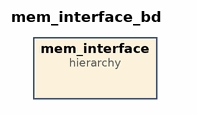
[diagram p0: block diagram of the top level]
# Vivado block design mem_interface_bd, xcku115-flva1517-2-e, Vivado 2018.1
create_bd_design mem_interface_bd

create_bd_cell -type hier mem_interface

# ---- hierarchy /mem_interface ----
current_bd_instance /mem_interface
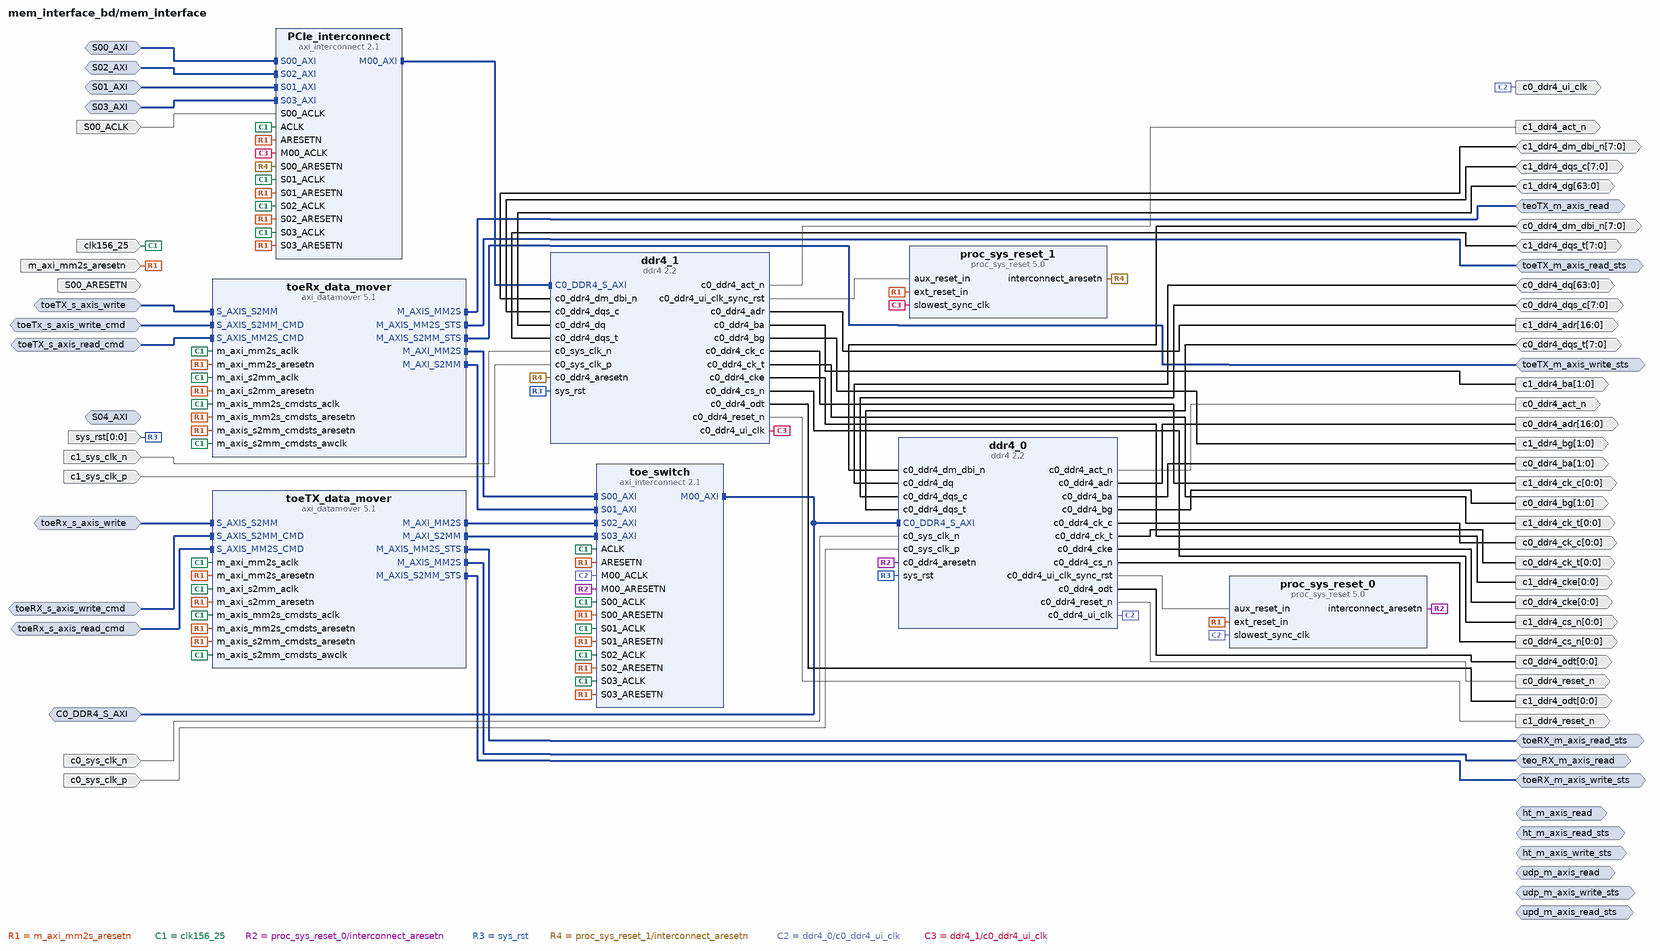
[diagram p1: block diagram inside /mem_interface]
create_bd_intf_pin -mode Master -vlnv xilinx.com:interface:axis_rtl:1.0 ht_m_axis_read
create_bd_intf_pin -mode Master -vlnv xilinx.com:interface:axis_rtl:1.0 udp_m_axis_write_sts
create_bd_intf_pin -mode Master -vlnv xilinx.com:interface:axis_rtl:1.0 ht_m_axis_write_sts
create_bd_intf_pin -mode Master -vlnv xilinx.com:interface:axis_rtl:1.0 toeRX_m_axis_read_sts
create_bd_intf_pin -mode Master -vlnv xilinx.com:interface:axis_rtl:1.0 teo_RX_m_axis_read
create_bd_intf_pin -mode Master -vlnv xilinx.com:interface:axis_rtl:1.0 ht_m_axis_read_sts
create_bd_intf_pin -mode Master -vlnv xilinx.com:interface:axis_rtl:1.0 toeRX_m_axis_write_sts
create_bd_intf_pin -mode Slave -vlnv xilinx.com:interface:axis_rtl:1.0 toeRx_s_axis_write
create_bd_intf_pin -mode Slave -vlnv xilinx.com:interface:axis_rtl:1.0 toeRX_s_axis_write_cmd
create_bd_intf_pin -mode Slave -vlnv xilinx.com:interface:aximm_rtl:1.0 S00_AXI
create_bd_intf_pin -mode Slave -vlnv xilinx.com:interface:aximm_rtl:1.0 S02_AXI
create_bd_intf_pin -mode Slave -vlnv xilinx.com:interface:aximm_rtl:1.0 S01_AXI
create_bd_intf_pin -mode Monitor -vlnv xilinx.com:interface:aximm_rtl:1.0 C0_DDR4_S_AXI
create_bd_intf_pin -mode Slave -vlnv xilinx.com:interface:axis_rtl:1.0 toeRx_s_axis_read_cmd
create_bd_intf_pin -mode Master -vlnv xilinx.com:interface:axis_rtl:1.0 udp_m_axis_read
create_bd_intf_pin -mode Slave -vlnv xilinx.com:interface:aximm_rtl:1.0 S04_AXI
create_bd_intf_pin -mode Slave -vlnv xilinx.com:interface:aximm_rtl:1.0 S03_AXI
create_bd_intf_pin -mode Master -vlnv xilinx.com:interface:axis_rtl:1.0 toeTX_m_axis_read_sts
create_bd_intf_pin -mode Master -vlnv xilinx.com:interface:axis_rtl:1.0 teoTX_m_axis_read
create_bd_intf_pin -mode Master -vlnv xilinx.com:interface:axis_rtl:1.0 toeTX_m_axis_write_sts
create_bd_intf_pin -mode Slave -vlnv xilinx.com:interface:axis_rtl:1.0 toeTX_s_axis_write
create_bd_intf_pin -mode Slave -vlnv xilinx.com:interface:axis_rtl:1.0 toeTx_s_axis_write_cmd
create_bd_intf_pin -mode Slave -vlnv xilinx.com:interface:axis_rtl:1.0 toeTX_s_axis_read_cmd
create_bd_intf_pin -mode Master -vlnv xilinx.com:interface:axis_rtl:1.0 upd_m_axis_read_sts
create_bd_pin -dir O c1_ddr4_reset_n
create_bd_pin -dir I -type clk clk156_25
create_bd_pin -dir O c0_ddr4_reset_n
create_bd_pin -dir O -from 1 -to 0 c0_ddr4_bg
create_bd_pin -dir O c0_ddr4_act_n
create_bd_pin -dir O -from 0 -to 0 c0_ddr4_odt
create_bd_pin -dir O -from 0 -to 0 c0_ddr4_cs_n
create_bd_pin -dir O -from 16 -to 0 c0_ddr4_adr
create_bd_pin -dir O -from 0 -to 0 -type clk c0_ddr4_ck_t
create_bd_pin -dir IO -from 7 -to 0 c0_ddr4_dqs_t
create_bd_pin -dir O -from 0 -to 0 -type clk c0_ddr4_ck_c
create_bd_pin -dir O -from 0 -to 0 c0_ddr4_cke
create_bd_pin -dir O -from 1 -to 0 c0_ddr4_ba
create_bd_pin -dir IO -from 63 -to 0 c0_ddr4_dq
create_bd_pin -dir O -from 1 -to 0 c1_ddr4_bg
create_bd_pin -dir IO -from 7 -to 0 c0_ddr4_dm_dbi_n
create_bd_pin -dir O -from 0 -to 0 c1_ddr4_odt
create_bd_pin -dir O c1_ddr4_act_n
create_bd_pin -dir O -from 16 -to 0 c1_ddr4_adr
create_bd_pin -dir O -from 1 -to 0 c1_ddr4_ba
create_bd_pin -dir O -from 0 -to 0 c1_ddr4_cke
create_bd_pin -dir O -from 0 -to 0 -type clk c1_ddr4_ck_c
create_bd_pin -dir O -from 0 -to 0 -type clk c1_ddr4_ck_t
create_bd_pin -dir IO -from 7 -to 0 c1_ddr4_dqs_c
create_bd_pin -dir IO -from 7 -to 0 c1_ddr4_dm_dbi_n
create_bd_pin -dir IO -from 63 -to 0 c1_ddr4_dg
create_bd_pin -dir IO -from 7 -to 0 c1_ddr4_dqs_t
create_bd_pin -dir O -from 0 -to 0 c1_ddr4_cs_n
create_bd_pin -dir IO -from 7 -to 0 c0_ddr4_dqs_c
create_bd_pin -dir I -from 0 -to 0 -type rst sys_rst
create_bd_pin -dir I -type clk c1_sys_clk_p
create_bd_pin -dir I -type clk c1_sys_clk_n
create_bd_pin -dir I -type clk c0_sys_clk_p
create_bd_pin -dir O -type clk c0_ddr4_ui_clk
create_bd_pin -dir I -type rst m_axi_mm2s_aresetn
create_bd_pin -dir I -type clk c0_sys_clk_n
create_bd_pin -dir I -type rst S00_ARESETN
create_bd_pin -dir I -type clk S00_ACLK

create_bd_cell -type ip -vlnv xilinx.com:ip:axi_datamover:5.1 toeRx_data_mover
set_property -dict [list \
  CONFIG.c_m_axi_mm2s_data_width 512 \
  CONFIG.c_m_axis_mm2s_tdata_width 64 \
  CONFIG.c_include_mm2s_dre true \
  CONFIG.c_mm2s_burst_size 16 \
  CONFIG.c_m_axi_s2mm_data_width 512 \
  CONFIG.c_include_s2mm_dre true \
  CONFIG.c_dummy 1 \
] [get_bd_cells toeRx_data_mover]
create_bd_cell -type ip -vlnv xilinx.com:ip:proc_sys_reset:5.0 proc_sys_reset_1
create_bd_cell -type ip -vlnv xilinx.com:ip:proc_sys_reset:5.0 proc_sys_reset_0
create_bd_cell -type ip -vlnv xilinx.com:ip:axi_datamover:5.1 toeTX_data_mover
set_property -dict [list \
  CONFIG.c_m_axi_mm2s_data_width 512 \
  CONFIG.c_m_axis_mm2s_tdata_width 64 \
  CONFIG.c_include_mm2s_dre true \
  CONFIG.c_mm2s_burst_size 16 \
  CONFIG.c_m_axi_s2mm_data_width 512 \
  CONFIG.c_include_s2mm_dre true \
  CONFIG.c_dummy 1 \
] [get_bd_cells toeTX_data_mover]
create_bd_cell -type ip -vlnv xilinx.com:ip:axi_interconnect:2.1 toe_switch
set_property -dict [list \
  CONFIG.NUM_SI 4 \
  CONFIG.NUM_MI 1 \
  CONFIG.ENABLE_ADVANCED_OPTIONS 1 \
  CONFIG.XBAR_DATA_WIDTH 512 \
  CONFIG.SYNCHRONIZATION_STAGES 3 \
  CONFIG.M00_HAS_REGSLICE 3 \
  CONFIG.S00_HAS_REGSLICE 3 \
  CONFIG.S01_HAS_REGSLICE 3 \
  CONFIG.S02_HAS_REGSLICE 3 \
  CONFIG.S03_HAS_REGSLICE 3 \
] [get_bd_cells toe_switch]
create_bd_cell -type ip -vlnv xilinx.com:ip:axi_interconnect:2.1 PCIe_interconnect
set_property -dict [list \
  CONFIG.NUM_SI 4 \
  CONFIG.NUM_MI 1 \
  CONFIG.ENABLE_ADVANCED_OPTIONS 1 \
  CONFIG.XBAR_DATA_WIDTH 512 \
  CONFIG.SYNCHRONIZATION_STAGES 3 \
  CONFIG.M00_HAS_REGSLICE 3 \
  CONFIG.S00_HAS_REGSLICE 3 \
  CONFIG.S01_HAS_REGSLICE 3 \
  CONFIG.S02_HAS_REGSLICE 3 \
  CONFIG.S03_HAS_REGSLICE 3 \
] [get_bd_cells PCIe_interconnect]
create_bd_cell -type ip -vlnv xilinx.com:ip:ddr4:2.2 ddr4_0
set_property -dict [list \
  CONFIG.C0.DDR4_DataWidth 64 \
  CONFIG.C0.DDR4_AxiDataWidth 512 \
  CONFIG.C0.DDR4_AxiAddressWidth 32 \
] [get_bd_cells ddr4_0]
create_bd_cell -type ip -vlnv xilinx.com:ip:ddr4:2.2 ddr4_1
set_property -dict [list \
  CONFIG.C0.DDR4_DataWidth 64 \
  CONFIG.C0.DDR4_AxiDataWidth 512 \
  CONFIG.C0.DDR4_AxiAddressWidth 32 \
] [get_bd_cells ddr4_1]

# ---- connections ----

current_bd_instance /mem_interface
connect_bd_intf_net [get_bd_intf_pins toeRx_data_mover/M_AXI_MM2S] [get_bd_intf_pins toe_switch/S00_AXI]
connect_bd_intf_net [get_bd_intf_pins toeRx_data_mover/M_AXI_S2MM] [get_bd_intf_pins toe_switch/S01_AXI]
connect_bd_intf_net [get_bd_intf_pins toeTX_data_mover/M_AXI_MM2S] [get_bd_intf_pins toe_switch/S02_AXI]
connect_bd_intf_net [get_bd_intf_pins toeTX_data_mover/M_AXI_S2MM] [get_bd_intf_pins toe_switch/S03_AXI]
connect_bd_intf_net -intf_net toe_switch_1_M00_AXI [get_bd_intf_pins PCIe_interconnect/M00_AXI] [get_bd_intf_pins ddr4_1/C0_DDR4_S_AXI]
connect_bd_intf_net -intf_net ht_udp_axi_switch_M00_AXI [get_bd_intf_pins toe_switch/M00_AXI] [get_bd_intf_pins ddr4_0/C0_DDR4_S_AXI]
connect_bd_intf_net [get_bd_intf_pins toe_switch/M00_AXI] [get_bd_intf_pins C0_DDR4_S_AXI]
connect_bd_intf_net [get_bd_intf_pins toeRX_m_axis_read_sts] [get_bd_intf_pins toeTX_data_mover/M_AXIS_MM2S_STS]
connect_bd_intf_net [get_bd_intf_pins teo_RX_m_axis_read] [get_bd_intf_pins toeTX_data_mover/M_AXIS_MM2S]
connect_bd_intf_net [get_bd_intf_pins toeRX_m_axis_write_sts] [get_bd_intf_pins toeTX_data_mover/M_AXIS_S2MM_STS]
connect_bd_intf_net [get_bd_intf_pins toeRx_s_axis_write] [get_bd_intf_pins toeTX_data_mover/S_AXIS_S2MM]
connect_bd_intf_net [get_bd_intf_pins toeRX_s_axis_write_cmd] [get_bd_intf_pins toeTX_data_mover/S_AXIS_S2MM_CMD]
connect_bd_intf_net [get_bd_intf_pins S00_AXI] [get_bd_intf_pins PCIe_interconnect/S00_AXI]
connect_bd_intf_net [get_bd_intf_pins S02_AXI] [get_bd_intf_pins PCIe_interconnect/S02_AXI]
connect_bd_intf_net [get_bd_intf_pins S01_AXI] [get_bd_intf_pins PCIe_interconnect/S01_AXI]
connect_bd_intf_net [get_bd_intf_pins toeRx_s_axis_read_cmd] [get_bd_intf_pins toeTX_data_mover/S_AXIS_MM2S_CMD]
connect_bd_intf_net [get_bd_intf_pins S03_AXI] [get_bd_intf_pins PCIe_interconnect/S03_AXI]
connect_bd_intf_net [get_bd_intf_pins toeTX_m_axis_read_sts] [get_bd_intf_pins toeRx_data_mover/M_AXIS_MM2S_STS]
connect_bd_intf_net [get_bd_intf_pins teoTX_m_axis_read] [get_bd_intf_pins toeRx_data_mover/M_AXIS_MM2S]
connect_bd_intf_net [get_bd_intf_pins toeTX_m_axis_write_sts] [get_bd_intf_pins toeRx_data_mover/M_AXIS_S2MM_STS]
connect_bd_intf_net [get_bd_intf_pins toeTX_s_axis_write] [get_bd_intf_pins toeRx_data_mover/S_AXIS_S2MM]
connect_bd_intf_net [get_bd_intf_pins toeTx_s_axis_write_cmd] [get_bd_intf_pins toeRx_data_mover/S_AXIS_S2MM_CMD]
connect_bd_intf_net [get_bd_intf_pins toeTX_s_axis_read_cmd] [get_bd_intf_pins toeRx_data_mover/S_AXIS_MM2S_CMD]
# net ddr4_bank_1_c0_ddr4_act_n has one end: 
connect_bd_net [get_bd_pins m_axi_mm2s_aresetn] \
  [get_bd_pins toeRx_data_mover/m_axi_mm2s_aresetn] [get_bd_pins toeRx_data_mover/m_axis_s2mm_cmdsts_aresetn] \
  [get_bd_pins toeRx_data_mover/m_axi_s2mm_aresetn] [get_bd_pins toeRx_data_mover/m_axis_mm2s_cmdsts_aresetn] \
  [get_bd_pins proc_sys_reset_1/ext_reset_in] [get_bd_pins proc_sys_reset_0/ext_reset_in] \
  [get_bd_pins toeTX_data_mover/m_axi_mm2s_aresetn] [get_bd_pins toeTX_data_mover/m_axis_s2mm_cmdsts_aresetn] \
  [get_bd_pins toeTX_data_mover/m_axi_s2mm_aresetn] [get_bd_pins toeTX_data_mover/m_axis_mm2s_cmdsts_aresetn] \
  [get_bd_pins toe_switch/ARESETN] [get_bd_pins toe_switch/S03_ARESETN] [get_bd_pins toe_switch/S02_ARESETN] \
  [get_bd_pins toe_switch/S00_ARESETN] [get_bd_pins toe_switch/S01_ARESETN] [get_bd_pins PCIe_interconnect/ARESETN] \
  [get_bd_pins PCIe_interconnect/S01_ARESETN] [get_bd_pins PCIe_interconnect/S02_ARESETN] \
  [get_bd_pins PCIe_interconnect/S03_ARESETN]
connect_bd_net -net m_axi_mm2s_aclk_1 [get_bd_pins clk156_25] \
  [get_bd_pins toeRx_data_mover/m_axi_mm2s_aclk] [get_bd_pins toeRx_data_mover/m_axis_s2mm_cmdsts_awclk] \
  [get_bd_pins toeRx_data_mover/m_axi_s2mm_aclk] [get_bd_pins toeRx_data_mover/m_axis_mm2s_cmdsts_aclk] \
  [get_bd_pins toeTX_data_mover/m_axi_mm2s_aclk] [get_bd_pins toeTX_data_mover/m_axis_s2mm_cmdsts_awclk] \
  [get_bd_pins toeTX_data_mover/m_axi_s2mm_aclk] [get_bd_pins toeTX_data_mover/m_axis_mm2s_cmdsts_aclk] \
  [get_bd_pins toe_switch/ACLK] [get_bd_pins toe_switch/S03_ACLK] [get_bd_pins toe_switch/S02_ACLK] \
  [get_bd_pins toe_switch/S00_ACLK] [get_bd_pins toe_switch/S01_ACLK] [get_bd_pins PCIe_interconnect/ACLK] \
  [get_bd_pins PCIe_interconnect/S01_ACLK] [get_bd_pins PCIe_interconnect/S02_ACLK] [get_bd_pins PCIe_interconnect/S03_ACLK]
connect_bd_net [get_bd_pins c0_sys_clk_n] [get_bd_pins ddr4_0/c0_sys_clk_n]
connect_bd_net [get_bd_pins c0_sys_clk_p] [get_bd_pins ddr4_0/c0_sys_clk_p]
connect_bd_net [get_bd_pins proc_sys_reset_0/interconnect_aresetn] [get_bd_pins ddr4_0/c0_ddr4_aresetn] [get_bd_pins toe_switch/M00_ARESETN]
connect_bd_net [get_bd_pins sys_rst] [get_bd_pins ddr4_0/sys_rst] [get_bd_pins ddr4_1/sys_rst]
connect_bd_net [get_bd_pins proc_sys_reset_1/interconnect_aresetn] [get_bd_pins ddr4_1/c0_ddr4_aresetn] [get_bd_pins PCIe_interconnect/S00_ARESETN]
connect_bd_net [get_bd_pins c1_sys_clk_n] [get_bd_pins ddr4_1/c0_sys_clk_n]
connect_bd_net [get_bd_pins c1_sys_clk_p] [get_bd_pins ddr4_1/c0_sys_clk_p]
connect_bd_net [get_bd_pins ddr4_0/c0_ddr4_adr] [get_bd_pins c0_ddr4_adr]
connect_bd_net [get_bd_pins ddr4_0/c0_ddr4_act_n] [get_bd_pins c0_ddr4_act_n]
connect_bd_net [get_bd_pins ddr4_0/c0_ddr4_ba] [get_bd_pins c0_ddr4_ba]
connect_bd_net [get_bd_pins ddr4_0/c0_ddr4_bg] [get_bd_pins c0_ddr4_bg]
connect_bd_net [get_bd_pins ddr4_0/c0_ddr4_ck_c] [get_bd_pins c0_ddr4_ck_c]
connect_bd_net [get_bd_pins ddr4_0/c0_ddr4_ck_t] [get_bd_pins c0_ddr4_ck_t]
connect_bd_net [get_bd_pins ddr4_0/c0_ddr4_cke] [get_bd_pins c0_ddr4_cke]
connect_bd_net [get_bd_pins ddr4_0/c0_ddr4_cs_n] [get_bd_pins c0_ddr4_cs_n]
connect_bd_net [get_bd_pins c0_ddr4_dm_dbi_n] [get_bd_pins ddr4_0/c0_ddr4_dm_dbi_n]
connect_bd_net [get_bd_pins c0_ddr4_dq] [get_bd_pins ddr4_0/c0_ddr4_dq]
connect_bd_net [get_bd_pins c0_ddr4_dqs_c] [get_bd_pins ddr4_0/c0_ddr4_dqs_c]
connect_bd_net [get_bd_pins c0_ddr4_dqs_t] [get_bd_pins ddr4_0/c0_ddr4_dqs_t]
connect_bd_net [get_bd_pins ddr4_0/c0_ddr4_odt] [get_bd_pins c0_ddr4_odt]
connect_bd_net [get_bd_pins ddr4_0/c0_ddr4_reset_n] [get_bd_pins c0_ddr4_reset_n]
connect_bd_net [get_bd_pins ddr4_1/c0_ddr4_act_n] [get_bd_pins c1_ddr4_act_n]
connect_bd_net [get_bd_pins ddr4_1/c0_ddr4_adr] [get_bd_pins c1_ddr4_adr]
connect_bd_net [get_bd_pins ddr4_1/c0_ddr4_ba] [get_bd_pins c1_ddr4_ba]
connect_bd_net [get_bd_pins ddr4_1/c0_ddr4_bg] [get_bd_pins c1_ddr4_bg]
connect_bd_net [get_bd_pins ddr4_1/c0_ddr4_ck_c] [get_bd_pins c1_ddr4_ck_c]
connect_bd_net [get_bd_pins ddr4_1/c0_ddr4_ck_t] [get_bd_pins c1_ddr4_ck_t]
connect_bd_net [get_bd_pins ddr4_1/c0_ddr4_cke] [get_bd_pins c1_ddr4_cke]
connect_bd_net [get_bd_pins ddr4_1/c0_ddr4_cs_n] [get_bd_pins c1_ddr4_cs_n]
connect_bd_net [get_bd_pins c1_ddr4_dm_dbi_n] [get_bd_pins ddr4_1/c0_ddr4_dm_dbi_n]
connect_bd_net [get_bd_pins c1_ddr4_dqs_c] [get_bd_pins ddr4_1/c0_ddr4_dqs_c]
connect_bd_net [get_bd_pins c1_ddr4_dqs_t] [get_bd_pins ddr4_1/c0_ddr4_dqs_t]
connect_bd_net [get_bd_pins ddr4_1/c0_ddr4_odt] [get_bd_pins c1_ddr4_odt]
connect_bd_net [get_bd_pins ddr4_1/c0_ddr4_reset_n] [get_bd_pins c1_ddr4_reset_n]
connect_bd_net [get_bd_pins ddr4_0/c0_ddr4_ui_clk] \
  [get_bd_pins c0_ddr4_ui_clk] [get_bd_pins toe_switch/M00_ACLK] [get_bd_pins proc_sys_reset_0/slowest_sync_clk]
connect_bd_net [get_bd_pins c1_ddr4_dg] [get_bd_pins ddr4_1/c0_ddr4_dq]
connect_bd_net [get_bd_pins ddr4_0/c0_ddr4_ui_clk_sync_rst] [get_bd_pins proc_sys_reset_0/aux_reset_in]
connect_bd_net [get_bd_pins ddr4_1/c0_ddr4_ui_clk_sync_rst] [get_bd_pins proc_sys_reset_1/aux_reset_in]
connect_bd_net [get_bd_pins ddr4_1/c0_ddr4_ui_clk] [get_bd_pins PCIe_interconnect/M00_ACLK] [get_bd_pins proc_sys_reset_1/slowest_sync_clk]
connect_bd_net [get_bd_pins S00_ACLK] [get_bd_pins PCIe_interconnect/S00_ACLK]

validate_bd_design
save_bd_design
